# Altium schematic sheet Copy of Plant_Monitor.SchDoc
size A; SheetNumber: 1; SheetTotal: 1
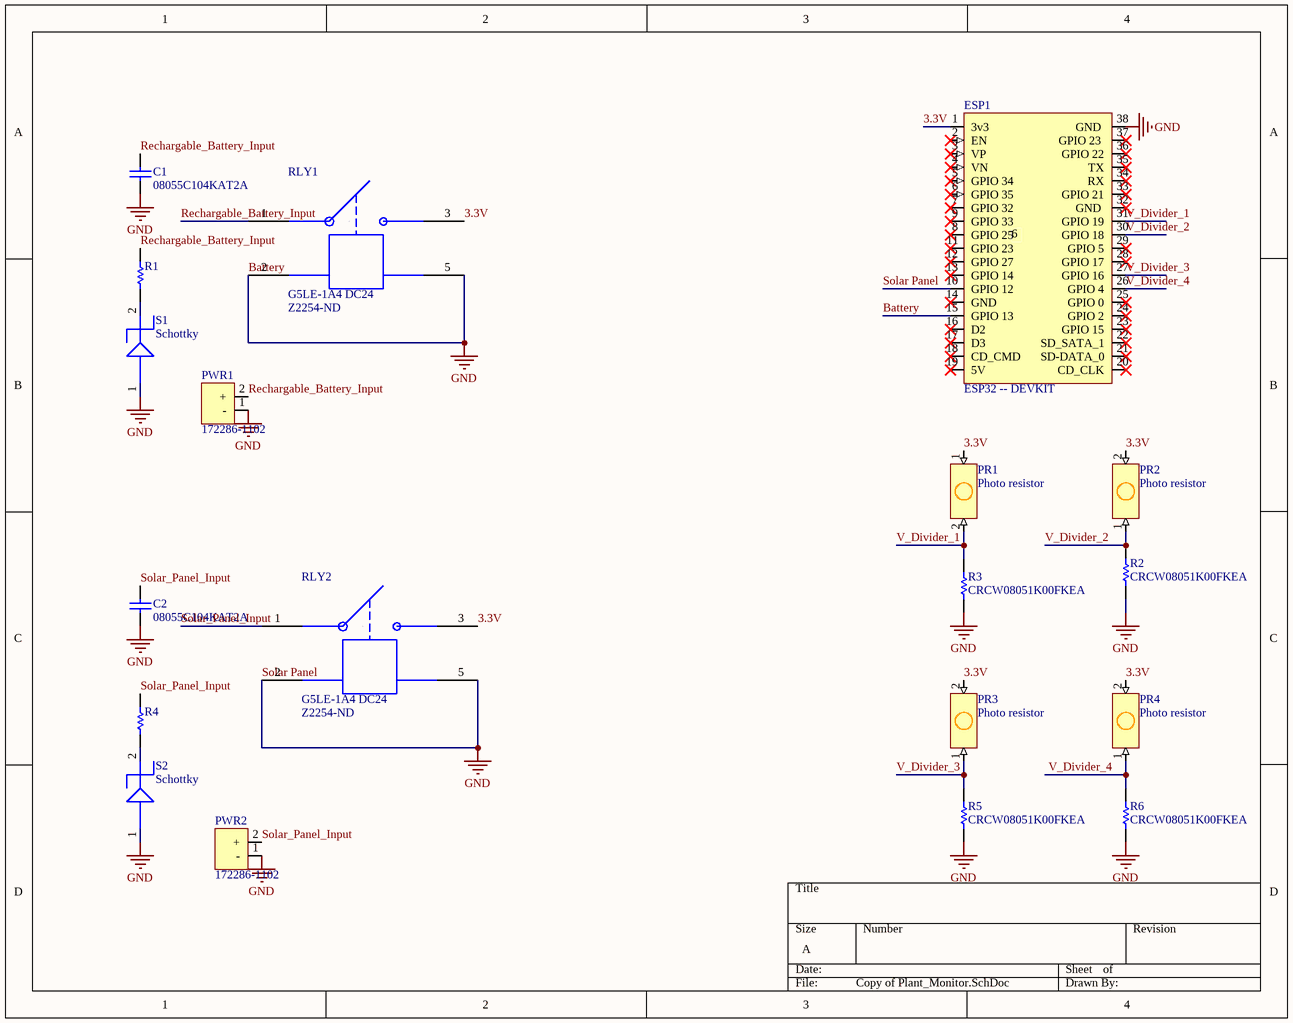
[diagram p0: Copy of Plant_Monitor.SchDoc]

## Parts
C1  08055C104KAT2A  [R0805]
C2  08055C104KAT2A  [R0805]
ESP1  ESP32 -- DEVKIT  [ESP32 -- DEVKITC]
PR1  Photo resistor  [Photoresistor]
PR2  Photo resistor  [Photoresistor]
PR3  Photo resistor  [Photoresistor]
PR4  Photo resistor  [Photoresistor]
PWR1  172286-1102  [2x1]
PWR2  172286-1102  [2x1]
R1  CRCW08051K00FKEA  [RESC2013X50X30NL20T20]  (value not drawn)
R2  CRCW08051K00FKEA  [RESC2013X50X30NL20T20]
R3  CRCW08051K00FKEA  [RESC2013X50X30NL20T20]
R4  CRCW08051K00FKEA  [RESC2013X50X30NL20T20]  (value not drawn)
R5  CRCW08051K00FKEA  [RESC2013X50X30NL20T20]
R6  CRCW08051K00FKEA  [RESC2013X50X30NL20T20]
RLY1  G5LE-1A4 DC24  Supplier Part Number 1: Z2254-ND  [24V RELAY]
RLY2  G5LE-1A4 DC24  Supplier Part Number 1: Z2254-ND  [24V RELAY]
S1  Schottky  [SODFL100X40-2N]
S2  Schottky  [SODFL100X40-2N]

## Nets
Battery: C1.1 C2.1 ESP1.10(GPIO_12) ESP1.15(GPIO_13) ESP1.38(GND) PWR1.1(-) PWR2.1(-) R2.1 R3.1 R5.1 R6.1 S1.1 S2.1  [also labelled GND, Solar Panel]
3.3V: ESP1.1(3v3) PR1.1 PR2.2 PR3.2 PR4.2
Rechargable_Battery_Input: C1.2 PWR1.2(+) R1.2
Solar_Panel_Input: C2.2 PWR2.2(+) R4.2
V_Divider_1: ESP1.31(GPIO_19) PR1.2 R3.2
V_Divider_2: ESP1.30(GPIO_18) PR2.1 R2.2
V_Divider_3: ESP1.27(GPIO_16) PR3.1 R5.2
V_Divider_4: ESP1.26(GPIO_4) PR4.1 R6.2
NetR1_1: R1.1 S1.2
NetR4_1: R4.1 S2.2

Not connected (* = marked no-connect by the designer): ESP1 2(EN)* 3(VP)* 4(VN)* 5(GPIO_34)* 6(GPIO_35)* 7(GPIO_32)* 8(GPIO_25)* 9(GPIO_33)* 11(GPIO_23)* 12(GPIO_27)* 13(GPIO_14)* 14(GND_)* 16(D2)* 17(D3)* 18(CD_CMD)* 19(5V)* 20(CD_CLK)* 21(SD-DATA_0)* 22(SD_SATA_1)* 23(GPIO_15)* 24(GPIO_2)* 25(GPIO_0)* 28(GPIO_17)* 29(GPIO_5)* 32(GND_)* 33(GPIO_21)* 34(RX)* 35(TX)* 36(GPIO_22)* 37(GPIO_23_)*; RLY1 1(0) 2(1) 3(2) 5(3); RLY2 1(0) 2(1) 3(2) 5(3)

## Notes on the sheet
- Labels drawn without touching a wire or pin: 3.3V

## Library data of the parts
C1 C2 = CAP-NP-2: Chip Capacitor, Ceramic, 0.1 uF, 10%, 50 V, 0805, RoHS, Tape and Reel; Manufacturer: AVX; Rated Voltage: 50V; Capacitance: 100nF; Dielectric: X7R; Case Size/Dimension: 0805; Tolerance (%): ±10%; Datasheet URL: http://www.farnell.com/datasheets/319609.pdf; Datasheet Version: Sep-07; Manufacturer URL: http://www.avx.com/
PWR1 PWR2 = 2 Pin Connector: MOLEX - 172286-1102. - CONNECTOR, HEADER, 2POS, 1ROW, 3.5MM; Voltage Rating: 400V; Number of Positions: 2; Current Rating: 14A; Connector Type: Male Pin; Pitch: 0.138inch; Gender: Male; Number of Pins: 2; Fastening Type: Latch; Orientation: Vertical; Number of Contacts: 2; Packaging: Tray; REACH SVHC: Unknown; Contact Material: Copper Alloy; Mount: Through Hole; Color: Black; Number of Rows: 1; Contact Plating: Tin; Number of Circuits: 2; Termination: Solder
R1-R6 = CMP-1013-00510-2: Manufacturer: Vishay Dale; Part Number: CRCW08051K00FKEA
RLY1 RLY2 = RELAY: Supplier 1: Digi-Key